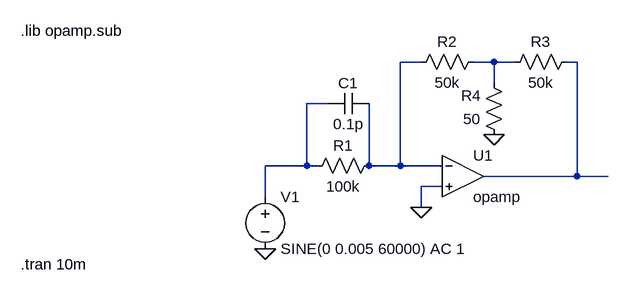
[diagram p0: schematic ex4_opamp.asc]
ex4_opamp.asc, the LTspice schematic file:
Version 4
SHEET 1 880 680
WIRE 240 -96 208 -96
WIRE 352 -96 320 -96
WIRE 384 -96 352 -96
WIRE 480 -96 464 -96
WIRE 352 -64 352 -96
WIRE 96 -32 64 -32
WIRE 64 64 64 -32
WIRE 64 64 0 64
WIRE 80 64 64 64
WIRE 160 64 160 -32
WIRE 208 64 208 -96
WIRE 208 64 160 64
WIRE 272 64 208 64
WIRE 480 80 480 -96
WIRE 480 80 336 80
WIRE 528 80 480 80
WIRE 272 96 240 96
WIRE 0 112 0 64
WIRE 240 128 240 96
FLAG 240 128 0
FLAG 352 16 0
FLAG 0 192 0
SYMBOL res 176 48 R90
WINDOW 0 0 56 VBottom 2
WINDOW 3 32 56 VTop 2
SYMATTR InstName R1
SYMATTR Value 100k
SYMBOL cap 160 -48 R90
WINDOW 0 0 32 VBottom 2
WINDOW 3 32 32 VTop 2
SYMATTR InstName C1
SYMATTR Value 0.1p
SYMBOL Opamps\\opamp 304 16 R0
SYMATTR InstName U1
SYMATTR SpiceLine Aol=1000K
SYMATTR SpiceLine2 GBW=250Meg
SYMBOL res 336 -112 R90
WINDOW 0 0 56 VBottom 2
WINDOW 3 32 56 VTop 2
SYMATTR InstName R2
SYMATTR Value 50k
SYMBOL res 480 -112 R90
WINDOW 0 0 56 VBottom 2
WINDOW 3 32 56 VTop 2
SYMATTR InstName R3
SYMATTR Value 50k
SYMBOL res 368 32 R180
WINDOW 0 36 76 Left 2
WINDOW 3 36 40 Left 2
SYMATTR InstName R4
SYMATTR Value 50
SYMBOL voltage 0 96 R0
SYMATTR InstName V1
SYMATTR Value SINE(0 0.005 60000) AC 1
TEXT -376 -144 Left 2 !.lib opamp.sub
TEXT -376 216 Left 2 !.tran 10m

The netlist it stands for:
* ex4_opamp.asc
R1 N001 N004 100k
C1 N001 N004 0.1p
XU1 N001 0 N003 opamp Aol=1000K GBW=250Meg  ; pins invin noninvin out
R2 N002 N001 50k
R3 N003 N002 50k
R4 0 N002 50
V1 N004 0 SINE(0 0.005 60000) AC 1
.lib opamp.sub
.tran 10m
.backanno
.end